# Altium schematic sheet SWD.SchDoc
size A4
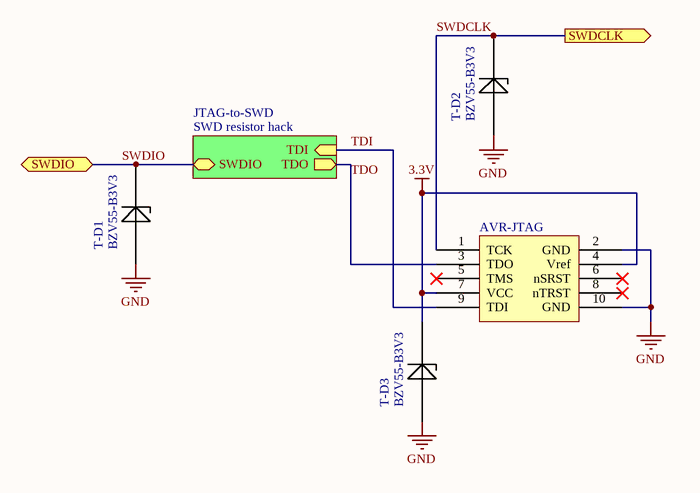
[diagram p0: SWD.SchDoc]

## Parts
AVR-JTAG  AVR Style  [Header 2x5 IDC-10S]  (value not drawn)
T-D1  BZV55-B3V3  [Minimelf]
T-D2  BZV55-B3V3  [Minimelf]
T-D3  BZV55-B3V3  [Minimelf]

## Sub-sheets
JTAG-to-SWD = SWD resistor hack: SWDIO (bidir), TDO (out), TDI (in)

## Ports
SWDCLK (out), SWDIO (bidir)

## Nets
3.3V: AVR-JTAG.4(Vref) AVR-JTAG.7(VCC) T-D3.1
GND: AVR-JTAG.2(GND) AVR-JTAG.10(GND) T-D1.2 T-D2.2 T-D3.2
SWDCLK: AVR-JTAG.1(TCK) T-D2.1 ; port SWDCLK
SWDIO: T-D1.1 ; port SWDIO, sheet JTAG-to-SWD/SWDIO
TDI: AVR-JTAG.9(TDI) ; sheet JTAG-to-SWD/TDI
TDO: AVR-JTAG.3(TDO) ; sheet JTAG-to-SWD/TDO

Not connected (* = marked no-connect by the designer): AVR-JTAG 5(TMS)* 6(nSRST)* 8(nTRST)*

## Library data of the parts
AVR-JTAG = Header JTAG AVR
T-D1-T-D3 = Zener Diode